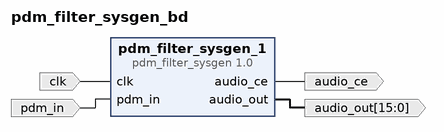
[diagram p0: block diagram of the top level]
# Vivado block design pdm_filter_sysgen_bd, xc7z007sclg225-1, Vivado 2017.1
create_bd_design pdm_filter_sysgen_bd

create_bd_port -dir O -type data audio_ce
create_bd_port -dir O -from 15 -to 0 -type data audio_out
create_bd_port -dir I -type clk clk
create_bd_port -dir I -type data pdm_in

create_bd_cell -type ip -vlnv Avnet_Inc:SysGen:pdm_filter_sysgen:1.0 pdm_filter_sysgen_1

# ---- connections ----

connect_bd_net [get_bd_pins pdm_filter_sysgen_1/audio_ce] [get_bd_ports audio_ce]
connect_bd_net [get_bd_pins pdm_filter_sysgen_1/audio_out] [get_bd_ports audio_out]
connect_bd_net [get_bd_ports clk] [get_bd_pins pdm_filter_sysgen_1/clk]
connect_bd_net [get_bd_ports pdm_in] [get_bd_pins pdm_filter_sysgen_1/pdm_in]

validate_bd_design
save_bd_design
